# EAGLE board unicycle (EAGLE 4.11)
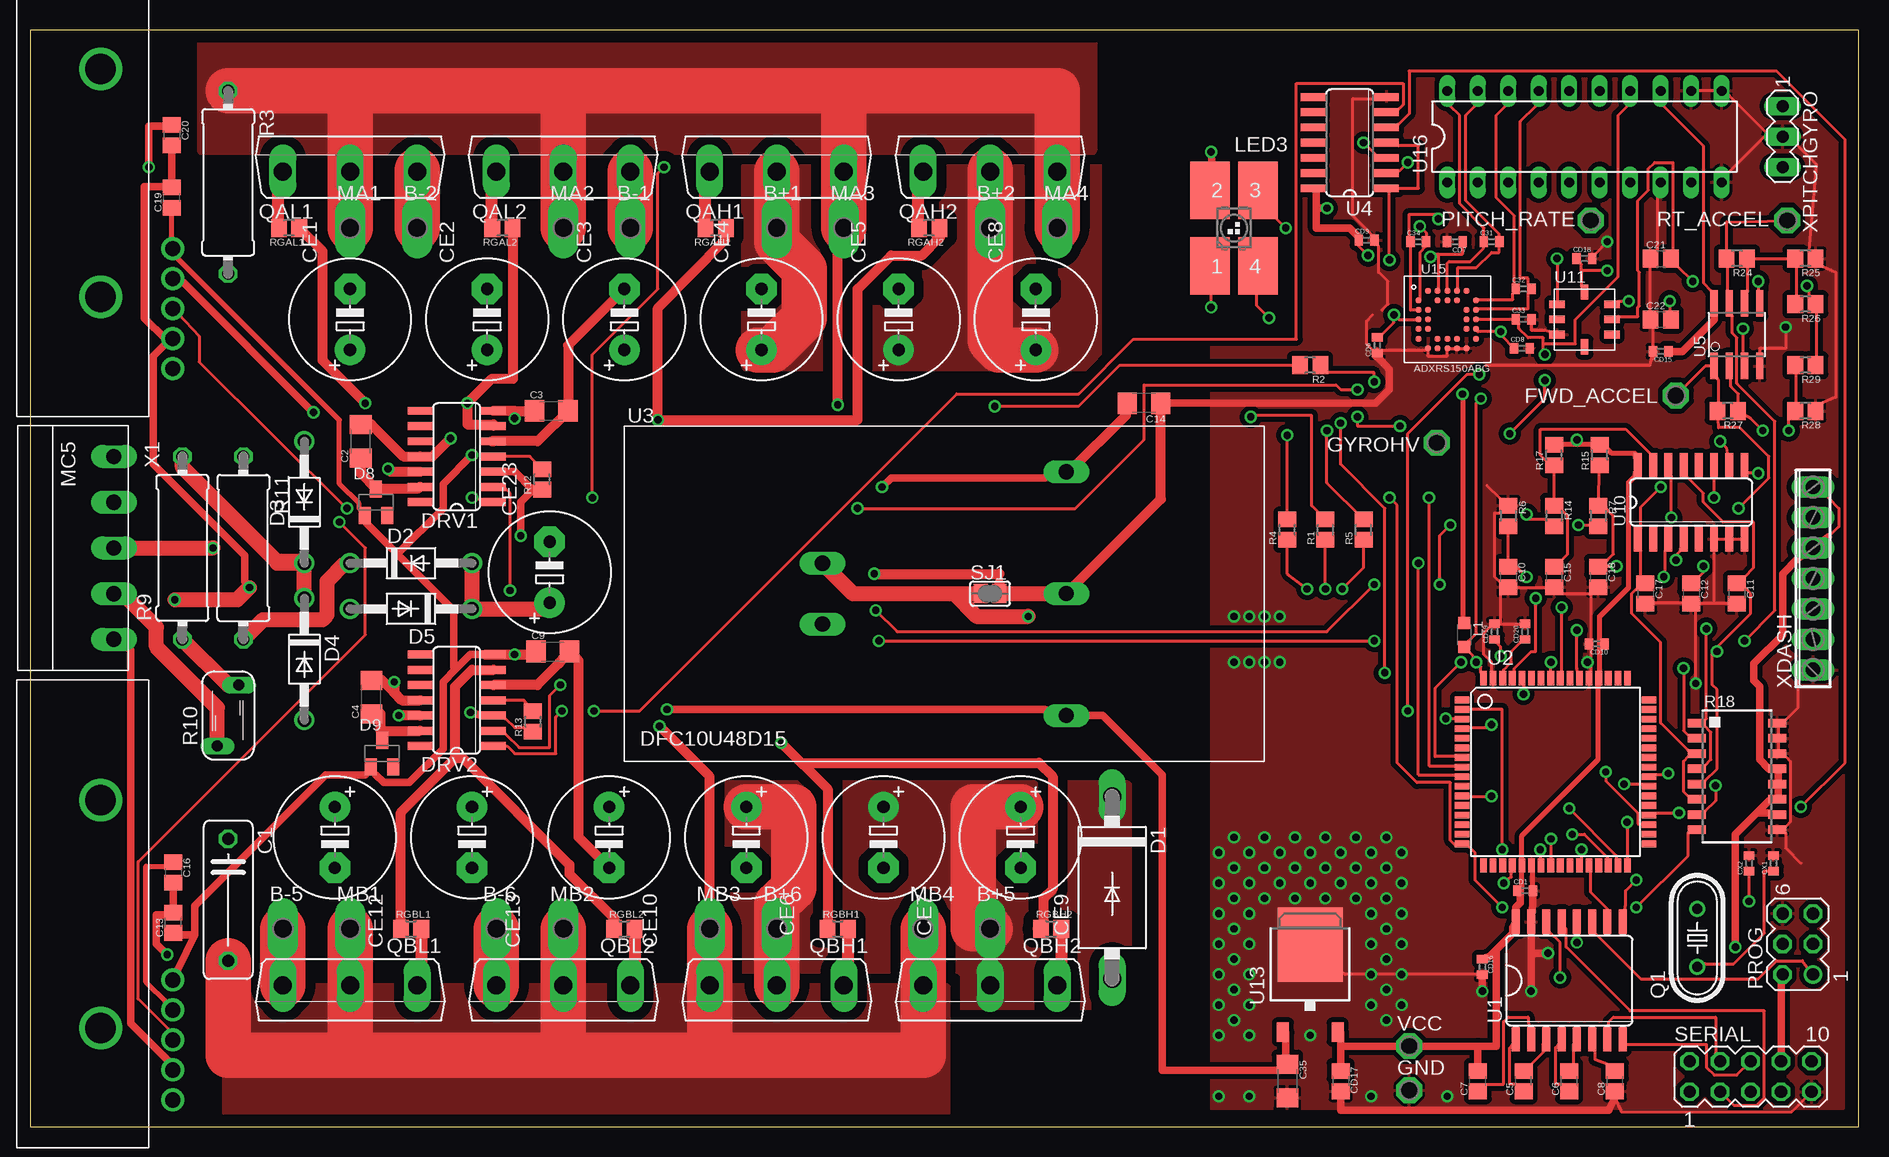
[diagram p3: board, top side]
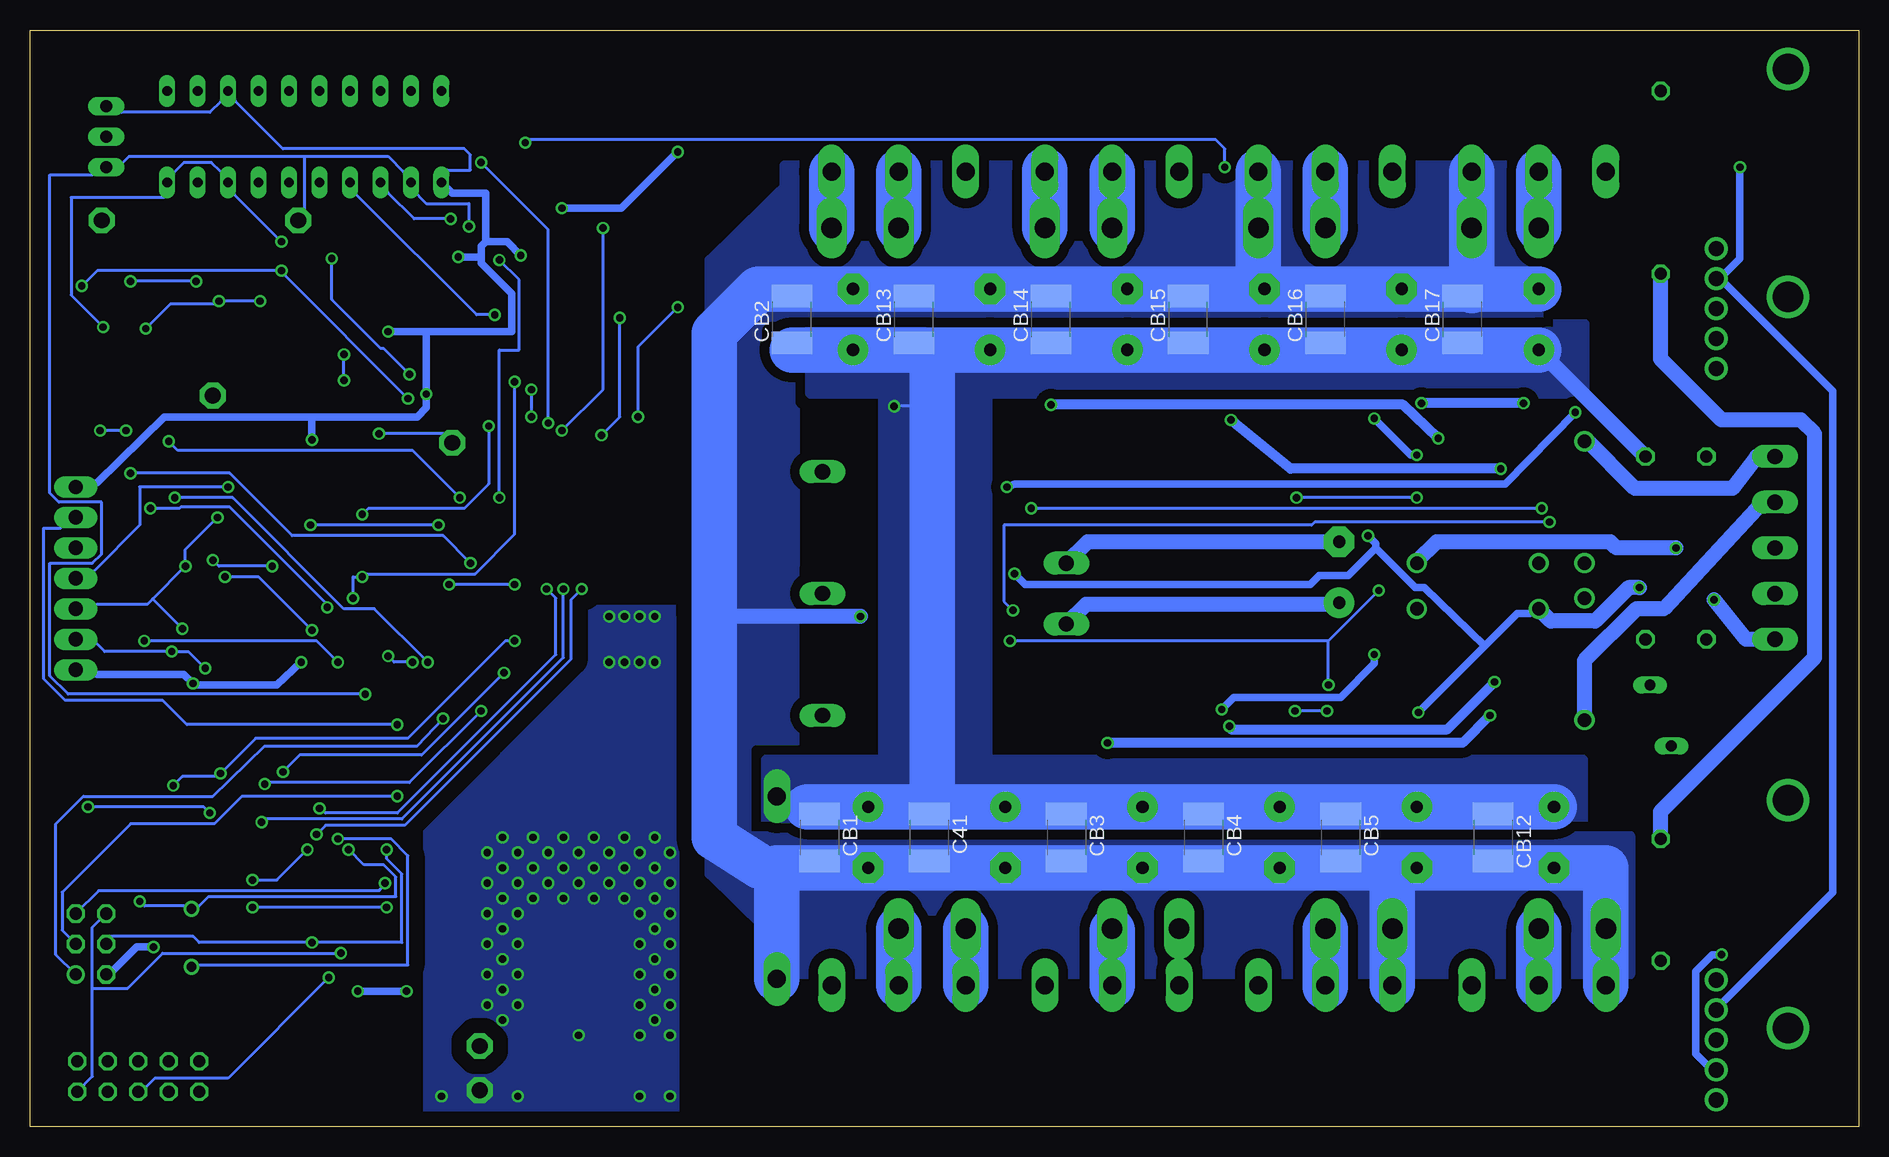
[diagram p4: board, bottom side, seen from below]

Size 152.4 x 91.44 mm. Coordinates in mm from the lower left corner, seen from the top.
Outline: 0,0 152.4,0 152.4,91.44 0,91.44 0,0
Copper layers (1*16): Top 0.035mm / dielectric 1.5mm / Bottom 0.035mm
Design rules "default": minimum track width 10mil, minimum drill 24mil, track to track 8mil, track to pad 8mil, pad to pad 8mil, via to via 8mil, smd to smd 8mil, copper to edge 40mil, drill to drill 8mil, minimum pad ring 10mil, minimum via ring 8mil, stop-mask expansion 4mil, vias tented up to drill 0mil, thermal gap 10mil
Net classes: 1 pwr: width 0.254 mm; 2 highsig: width 0.406 mm, clearance 0.61 mm; 3 highpwr: width 0.61 mm, clearance 0.61 mm

## Footprints (pad centres in the part's own frame; a part is rotated, then mirrored left to right if it is on the bottom)
P1-17Y = drill 1.702 pad 2.121 long: 1 0,0
L08P = drill 1.27 round: 1 -3,-3; 2 -5.5,-3; 3 -8,-3; 4 -10.5,-3; 5 -13,-3 | drill 2.54 round: P$6 -7,3; P$7 12,3
C102-043X133 = drill 1.016 octagon: 1 -5.08,0; 2 5.08,0
C1206 = smd 1.6 x 1.8: 1 -1.4,0; 2 1.4,0
C0805 = smd 1.3 x 1.5: 1 -0.85,0; 2 0.85,0
C0402 = smd 0.7 x 0.9: 1 -0.65,0; 2 0.65,0
C1812 = smd 1.9 x 3.4: 1 -1.95,0; 2 1.95,0
E5-10,5 = drill 1.016 pad 2.54 round: + -2.54,0 | drill 1.016 pad 2.54 octagon: - 2.54,0
DO201-15 = drill 1.499 long: A 7.62,0; C -7.62,0
DO41-10 = drill 1.118 round: A 5.08,0; C -5.08,0
SOT23 = smd 1 x 1.4: 1 -0.95,-1.1; 2 0.95,-1.1; 3 0,1.1
14-SOIC = smd 0.66 x 2.032: 1 -3.81,-3.073; 2 -2.54,-3.073; 3 -1.27,-3.073; 4 0,-3.073; 5 1.27,-3.073; 6 2.54,-3.073; 7 3.81,-3.073; 8 3.81,3.073; 9 2.54,3.073; 10 1.27,3.073; 11 0,3.073; 12 -1.27,3.073; 13 -2.54,3.073; 14 -3.81,3.073
P1-13 = drill 1.321 pad 2.159 octagon: 1 0,0
L2012C = smd 1 x 1: 1 -1,0; 2 1,0
P-LCC-4-3 = smd 3.3 x 4.8: 1 -2,-3.15; 2 -2,3.15; 3 2,3.15; 4 2,-3.15
MA03-2 = drill 1.016 round: 1 -2.54,-1.27 | drill 1.016 octagon: 2 -2.54,1.27; 3 0,-1.27; 4 0,1.27; 5 2.54,-1.27; 6 2.54,1.27
HC49/S = drill 0.813 round: 1 -2.413,0; 2 2.413,0
TO247BV = drill 1.499 long: D 0,-2.921; G -5.588,-2.921; S 5.588,-2.921
R0805 = smd 1.3 x 1.5: 1 -0.85,0; 2 0.85,0
0414/15 = drill 1.016 octagon: 1 -7.62,0; 2 7.62,0
S05K40 = drill 0.914 long: 1 -0.889,-2.54; 2 0.889,2.54
4816P = smd 0.7 x 1.5: 1 -4.445,-3.346; 2 -3.175,-3.346; 3 -1.905,-3.346; 4 -0.635,-3.346; 5 0.635,-3.346; 6 1.905,-3.346; 7 3.175,-3.346; 8 4.445,-3.346; 9 4.445,3.346; 10 3.175,3.346; 11 1.905,3.346; 12 0.635,3.346; 13 -0.635,3.346; 14 -1.905,3.346; 15 -3.175,3.346; 16 -4.445,3.346
MA05-2 = drill 1.016 octagon: 1 -5.08,-1.27; 2 -5.08,1.27; 3 -2.54,-1.27; 4 -2.54,1.27; 5 0,-1.27; 6 0,1.27; 7 2.54,-1.27; 8 2.54,1.27; 9 5.08,-1.27; 10 5.08,1.27
SJ = smd 1.168 x 1.6: 1 -0.762,0; 2 0.762,0
SO16L = smd 0.66 x 2.032: 1 -4.445,-4.902; 2 -3.175,-4.902; 3 -1.905,-4.902; 4 -0.635,-4.902; 5 0.635,-4.902; 6 1.905,-4.902; 7 3.175,-4.902; 8 4.445,-4.902; 9 4.445,4.902; 10 3.175,4.902; 11 1.905,4.902; 12 0.635,4.902; 13 -0.635,4.902; 14 -1.905,4.902; 15 -3.175,4.902; 16 -4.445,4.902
TQFP64 = smd 1.194 x 0.559: 1 -7.8,6; 2 -7.8,5.2; 3 -7.8,4.4; 4 -7.8,3.6; 5 -7.8,2.8; 6 -7.8,2; 7 -7.8,1.2; 8 -7.8,0.4; 9 -7.8,-0.4; 10 -7.8,-1.2; 11 -7.8,-2; 12 -7.8,-2.8; 13 -7.8,-3.6; 14 -7.8,-4.4; 15 -7.8,-5.2; 16 -7.8,-6; 33 7.8,-6; 34 7.8,-5.2; 35 7.8,-4.4; 36 7.8,-3.6; 37 7.8,-2.8; 38 7.8,-2; 39 7.8,-1.2; 40 7.8,-0.4; 41 7.8,0.4; 42 7.8,1.2; 43 7.8,2; 44 7.8,2.8; 45 7.8,3.6; 46 7.8,4.4; 47 7.8,5.2; 48 7.8,6 | smd 0.559 x 1.194: 17 -6,-7.8; 18 -5.2,-7.8; 19 -4.4,-7.8; 20 -3.6,-7.8; 21 -2.8,-7.8; 22 -2,-7.8; 23 -1.2,-7.8; 24 -0.4,-7.8; 25 0.4,-7.8; 26 1.2,-7.8; 27 2,-7.8; 28 2.8,-7.8; 29 3.6,-7.8; 30 4.4,-7.8; 31 5.2,-7.8; 32 6,-7.8; 49 6,7.8; 50 5.2,7.8; 51 4.4,7.8; 52 3.6,7.8; 53 2.8,7.8; 54 2,7.8; 55 1.2,7.8; 56 0.4,7.8; 57 -0.4,7.8; 58 -1.2,7.8; 59 -2,7.8; 60 -2.8,7.8; 61 -3.6,7.8; 62 -4.4,7.8; 63 -5.2,7.8; 64 -6,7.8
DFC10 = drill 1.27 long: 1 0,-2.54; 2 0,2.54; 3 20.32,-10.16; 4 20.32,0; 5 20.32,10.16
SO14 = smd 0.66 x 2.032: 1 -3.81,-3.073; 2 -2.54,-3.073; 3 -1.27,-3.073; 4 0,-3.073; 5 1.27,-3.073; 6 2.54,-3.073; 7 3.81,-3.073; 8 3.81,3.073; 9 2.54,3.073; 10 1.27,3.073; 11 0,3.073; 12 -1.27,3.073; 13 -2.54,3.073; 14 -3.81,3.073
SO08 = smd 0.61 x 2.21: 1 -1.905,-2.616; 2 -0.635,-2.616; 3 0.635,-2.616; 4 1.905,-2.616; 5 1.905,2.616; 6 0.635,2.616; 7 -0.635,2.616; 8 -1.905,2.616
SO16 = smd 0.66 x 2.032: 1 -4.445,-3.073; 2 -3.175,-3.073; 3 -1.905,-3.073; 4 -0.635,-3.073; 5 0.635,-3.073; 6 1.905,-3.073; 7 3.175,-3.073; 8 4.445,-3.073; 9 4.445,3.073; 10 3.175,3.073; 11 1.905,3.073; 12 0.635,3.073; 13 -0.635,3.073; 14 -1.905,3.073; 15 -3.175,3.073; 16 -4.445,3.073
E-8 = smd 1.27 x 0.635: 1 -2.286,1.27; 2 -2.286,0; 3 -2.286,-1.27; 5 2.286,-1.27; 6 2.286,0; 7 2.286,1.27 | smd 0.635 x 1.27: 4 0,-2.286; 8 0,2.286
TO252 = smd 1 x 1.6: 1 -2.28,-4.8; 2 2.28,-4.8 | smd 5.4 x 6.2: 3 0,2.5
BC-32 = smd 0.5 x 0.5: A2 -1.6,2.4; A3 -0.8,2.4; A4 0,2.4; A5 0.8,2.4; A6 1.6,2.4; B1 -2.4,1.6; B3 -0.8,1.6; B4 0,1.6; B5 0.8,1.6; B7 2.4,1.6; C1 -2.4,0.8; C2 -1.6,0.8; C6 1.6,0.8; C7 2.4,0.8; D1 -2.4,0; D2 -1.6,0; D6 1.6,0; D7 2.4,0; E1 -2.4,-0.8; E2 -1.6,-0.8; E6 1.6,-0.8; E7 2.4,-0.8; F1 -2.4,-1.6; F3 -0.8,-1.6; F4 0,-1.6; F5 0.8,-1.6; F7 2.4,-1.6; G2 -1.6,-2.4; G3 -0.8,-2.4; G4 0,-2.4; G5 0.8,-2.4; G6 1.6,-2.4
DIL20 = drill 0.813 long: 1 -11.43,-3.81; 2 -8.89,-3.81; 3 -6.35,-3.81; 4 -3.81,-3.81; 5 -1.27,-3.81; 6 1.27,-3.81; 7 3.81,-3.81; 8 6.35,-3.81; 9 8.89,-3.81; 10 11.43,-3.81; 11 11.43,3.81; 12 8.89,3.81; 13 6.35,3.81; 14 3.81,3.81; 15 1.27,3.81; 16 -1.27,3.81; 17 -3.81,3.81; 18 -6.35,3.81; 19 -8.89,3.81; 20 -11.43,3.81
MC5 = drill 1.27 long: 1 -7.62,0; 2 -3.81,0; 3 0,0; 4 3.81,0; 5 7.62,0
7POL254 = drill 1.2 long: 1 -7.62,0; 2 -5.08,0; 3 -2.54,0; 4 0,0; 5 2.54,0; 6 5.08,0; 7 7.62,0
MA03-1 = drill 1.016 long: 1 -2.54,0; 2 0,0; 3 2.54,0

## Placement (x,y rotation side)
B+1  PTR1PAD1-17Y  [P1-17Y]  62.23,74.93 0 top
B+2  PTR1PAD1-17Y  [P1-17Y]  80.01,74.93 0 top
B+5  PTR1PAD1-17Y  [P1-17Y]  80.01,16.51 0 top
B+6  PTR1PAD1-17Y  [P1-17Y]  62.23,16.51 0 top
B-1  PTR1PAD1-17Y  [P1-17Y]  50.04,74.93 0 top
B-2  PTR1PAD1-17Y  [P1-17Y]  32.26,74.93 0 top
B-5  PTR1PAD1-17Y  [P1-17Y]  21.08,16.51 0 top
B-6  PTR1PAD1-17Y  [P1-17Y]  38.86,16.51 0 top
BATIS  L08P150D15  [L08P]  8.89,15.24 90 top
C1  0.022uF100v  [C102-043X133]  16.51,18.92 270 top
C2  10uF25v  [C1206]  27.56,57.15 90 top
C3  10uF25v  [C1206]  43.43,59.69 0 top
C4  10uF25v  [C1206]  28.45,35.81 90 top
C5  1.0uF  [C0805]  124.46,3.81 90 top
C6  1.0uF  [C0805]  128.27,3.81 90 top
C7  1.0uF  [C0805]  120.65,3.81 90 top
C8  1.0uF  [C0805]  132.08,3.81 90 top
C9  10uF25v  [C1206]  43.56,39.62 0 top
C10  0.1uF  [C0805]  123.19,45.85 270 top
C11  0.1uF  [C0805]  142.24,44.45 270 top
C12  0.1uF  [C0805]  138.43,44.45 270 top
C13  0.1uF 25v  [C0805]  11.94,17.02 90 top
C14  10uF 25v  [C1206]  92.84,60.33 180 top
C15  0.1uF  [C0805]  127,45.85 270 top
C16  0.1uF 25v  [C0805]  11.94,21.21 270 top
C17  0.1uF  [C0805]  134.62,44.45 270 top
C18  0.1uF  [C0805]  130.68,45.85 270 top
C19  0.1uF 25v  [C0805]  11.81,77.47 90 top
C20  0.1uF 25v  [C0805]  11.81,82.68 270 top
C21  0.22uF  [C0805]  135.89,72.39 0 top
C22  0.22uF  [C0805]  135.89,67.31 0 top
C31  22nF  [C0402]  121.79,73.79 0 top
C32  22nF  [C0402]  124.46,69.85 0 top
C33  47nF  [C0402]  124.46,67.31 0 top
C34  10nF  [C0402]  115.7,73.79 0 top
C35  10uF 25v  [C1206]  104.78,3.81 270 top
C41  1uF100v  [C1812]  77.47,24.13 270 bottom
CB1  1uF100v  [C1812]  86.61,24.13 270 bottom
CB2  1uF100v  [C1812]  88.9,67.31 90 bottom
CB3  1uF100v  [C1812]  66.04,24.13 270 bottom
CB4  1uF100v  [C1812]  54.61,24.13 270 bottom
CB5  1uF100v  [C1812]  43.18,24.13 270 bottom
CB12  1uF100v  [C1812]  30.48,24.13 270 bottom
CB13  1uF100v  [C1812]  78.74,67.31 90 bottom
CB14  1uF100v  [C1812]  67.31,67.31 90 bottom
CB15  1uF100v  [C1812]  55.88,67.31 90 bottom
CB16  1uF100v  [C1812]  44.45,67.31 90 bottom
CB17  1uF100v  [C1812]  33.02,67.31 90 bottom
CD1  1uF 6v  [C0402]  124.59,19.68 0 top
CD6  1uF 6v  [C0402]  112.27,65.15 90 top
CD7  1uF 6v  [C0402]  118.75,73.79 180 top
CD8  1uF 6v  [C0402]  124.33,64.9 0 top
CD9  1uF 6v  [C0402]  111.38,73.91 0 top
CD10  1uF 6v  [C0402]  130.56,40.26 180 top
CD15  1uF 6v  [C0402]  135.89,64.64 180 top
CD16  1uF 6v  [C0402]  121.03,13.34 270 top
CD17  10uF 6v  [C0805]  109.22,3.81 270 top
CD18  1uF 6v  [C0402]  129.54,72.39 0 top
CD19  1uF 6v  [C0402]  122.05,41.27 90 top
CD20  1uF 6v  [C0402]  124.59,41.27 90 top
CE1  220uF 63v  [E5-10,5]  26.67,67.31 90 top
CE2  220uF 63v  [E5-10,5]  38.1,67.31 90 top
CE3  220uF 63v  [E5-10,5]  49.53,67.31 90 top
CE4  220uF 63v  [E5-10,5]  60.96,67.31 90 top
CE5  220uF 63v  [E5-10,5]  72.39,67.31 90 top
CE6  220uF 63v  [E5-10,5]  59.69,24.13 270 top
CE7  220uF 63v  [E5-10,5]  71.12,24.13 270 top
CE8  220uF 63v  [E5-10,5]  83.82,67.31 90 top
CE9  220uF 63v  [E5-10,5]  82.55,24.13 270 top
CE10  220uF 63v  [E5-10,5]  48.26,24.13 270 top
CE12  220uF 63v  [E5-10,5]  25.4,24.13 270 top
CE13  220uF 63v  [E5-10,5]  36.83,24.13 270 top
CE23  220uF63v  [E5-10,5]  43.31,46.23 90 top
CX1  18pF  [C0402]  145.29,21.97 90 top
CX2  18pF  [C0402]  143.26,21.97 90 top
D1  1.5ke51  [DO201-15]  90.17,19.94 270 top
D2  1N4004  [DO41-10]  31.75,46.99 0 top
D3  1N4004  [DO41-10]  22.86,52.07 90 top
D4  1N4004  [DO41-10]  22.86,38.99 270 top
D5  1N4004  [DO41-10]  31.75,43.18 180 top
D8  BAS21  [SOT23]  28.83,52.07 0 top
D9  BAS21  [SOT23]  29.34,31.11 0 top
DRV1  IR21844S  [14-SOIC]  35.56,55.88 90 top
DRV2  IR21844S  [14-SOIC]  35.56,35.56 90 top
FWD_ACCEL  TPSPAD1-13  [P1-13]  137.16,60.96 0 top
GND  TPPAD1-13  [P1-13]  114.94,3.05 0 top
GYROHV  TPSPAD1-13  [P1-13]  117.22,57.02 0 top
L1  10uH  [L2012C]  119.51,41.02 270 top
LED3  SML-LX2832SISUGSBC  [P-LCC-4-3]  100.33,74.93 0 top
MA1  PTR1PAD1-17Y  [P1-17Y]  26.67,74.93 0 top
MA2  PTR1PAD1-17Y  [P1-17Y]  44.45,74.93 0 top
MA3  PTR1PAD1-17Y  [P1-17Y]  67.82,74.93 0 top
MA4  PTR1PAD1-17Y  [P1-17Y]  85.6,74.93 0 top
MB1  PTR1PAD1-17Y  [P1-17Y]  26.67,16.51 0 top
MB2  PTR1PAD1-17Y  [P1-17Y]  44.45,16.51 0 top
MB3  PTR1PAD1-17Y  [P1-17Y]  56.64,16.51 0 top
MB4  PTR1PAD1-17Y  [P1-17Y]  74.42,16.51 0 top
PITCH_RATE  TPSPAD1-13  [P1-13]  130.05,75.56 0 top
PROG  [MA03-2]  147.32,15.24 90 top
Q1  14.7  [HC49/S]  138.94,15.75 90 top
QAH1  IRFP2907  [TO247BV]  62.23,82.55 0 top
QAH2  IRFP2907  [TO247BV]  80.01,82.55 0 top
QAL1  IRFP2907  [TO247BV]  26.67,82.55 0 top
QAL2  IRFP2907  [TO247BV]  44.45,82.55 0 top
QBH1  IRFP2907  [TO247BV]  62.23,8.89 180 top
QBH2  IRFP2907  [TO247BV]  80.01,8.89 180 top
QBL1  IRFP2907  [TO247BV]  26.67,8.89 180 top
QBL2  IRFP2907  [TO247BV]  44.45,8.89 180 top
R1  240  [R0805]  107.95,49.78 90 top
R2  190k  [R0805]  106.68,63.5 180 top
R3  5ohm 2W  [0414/15]  16.51,78.74 270 top
R4  240  [R0805]  104.78,49.78 90 top
R5  240  [R0805]  111.12,49.78 90 top
R6  10k  [R0805]  123.19,50.93 270 top
R7  10k 0.1%  [R0805]  130.68,50.93 270 top
R9  5ohm 2W  [0414/15]  12.7,48.26 90 top
R10  mf-rx110  [S05K40]  16.51,34.29 0 top
R11  1ohm 2W  [0414/15]  17.78,48.26 270 top
R12  20k  [R0805]  42.67,53.98 90 top
R13  20k  [R0805]  41.91,33.78 90 top
R14  10k 0.1%  [R0805]  127,50.93 270 top
R15  10k 0.1%  [R0805]  130.81,56.01 90 top
R17  10k 0.1%  [R0805]  127,56.01 90 top
R18  10k  [4816P]  142.24,29.21 270 top
R24  10k 0.1%  [R0805]  142.24,72.39 180 top
R25  10k 0.1%  [R0805]  147.96,72.39 180 top
R26  10k 0.1%  [R0805]  147.96,68.58 180 top
R27  10k 0.1%  [R0805]  141.48,59.69 180 top
R28  10k 0.1%  [R0805]  147.96,59.69 180 top
R29  10k 0.1%  [R0805]  147.96,63.5 180 top
RGAH1  5  [R0805]  57.15,74.93 180 top
RGAH2  5  [R0805]  74.93,74.93 180 top
RGAL1  5  [R0805]  21.59,74.93 180 top
RGAL2  5  [R0805]  39.37,74.93 180 top
RGBH1  5  [R0805]  67.31,16.51 0 top
RGBH2  5  [R0805]  85.09,16.51 0 top
RGBL1  5  [R0805]  31.75,16.51 0 top
RGBL2  5  [R0805]  49.53,16.51 0 top
RMIS  L08P150D15  [L08P]  8.89,76.2 90 top
RT_ACCEL  TPSPAD1-13  [P1-13]  146.43,75.56 0 top
SERIAL  [MA05-2]  143.38,4.19 0 top
SJ1  [SJ]  80.01,44.45 0 top
U1  MAX232ECWE  [SO16L]  128.27,12.19 0 top
U2  MEGA128-A  [TQFP64]  127.13,29.59 0 top
U3  DFC10U48D15  [DFC10]  66.04,44.45 0 top
U4  74HC08D  [SO14]  109.98,82.04 90 top
U5  OPA2340U  [SO08]  142.24,66.04 0 top
U10  74HC4051D  [SO16]  138.43,52.07 0 top
U11  ADXL311JE  [E-8]  129.54,67.31 0 top
U13  LM78M05CDT  [TO252]  106.68,12.7 0 top
U15  ADXRS150ABG  [BC-32]  118.11,67.31 0 top
U16  ADXRS150ABGEB  [DIL20]  129.54,82.55 0 top
VCC  TPPAD1-13  [P1-13]  114.94,6.73 0 top
X1  MC5  [MC5]  6.99,48.26 270 top
XDASH  [7POL254]  148.59,45.72 90 top
XPITCHGYRO  [MA03-1]  146.05,82.55 270 top

## Tracks (layer width: path | path; a pad name or v marks a point on that pad's centre or on a via)
+15V  (via drill 0.61)
  Top 0.254: U13.1 104.65,7.11 C35.1 | 28.83,29.34 D9.1 27.94,29.34
  Top 0.406: 35.5,38.16 35.31,38.35 | D8.1 27.43,51.56 27.43,51.94 25.78,53.59 25.78,58.93 12.32,72.39 RMIS.1 11.81,74.04 C19.1
  Top 0.61: U13.1 104.65,7.87 104.65,4.7 94.36,4.7 94.36,29.34 89.41,34.29 U3.3 84.58,34.8 v53.09,34.8 | 28.83,29.34 29.46,28.7 31.62,28.7 34.42,31.5 34.42,37.08 35.5,38.16 36.7,39.37 37.97,39.37 | 30.61,47.75 35.31,43.05 35.31,38.35 | 30.35,48.01 28.07,50.29 D8.1 | v36.83,56.01 34.42,53.59 34.42,51.56 30.61,47.75 | v40.39,59.05 40.39,59.69 | 30.35,48.01 30.29,48.07 | 30.61,47.75 30.35,48.01 | 13.72,16 12.32,13.08 BATIS.1 | 13.72,16 13.72,18.41 24.64,29.34 27.94,29.34 | 13.72,16 12.57,16 C13.1
  Top 0.813: 37.97,39.37 DRV2.7 v40.39,39.37 41.91,39.37 C9.1 | C3.1 40.39,59.69 DRV1.7
  Bottom 0.61: v40.39,59.05 37.34,56.01 v36.83,56.01 | v40.39,39.37 40.39,38.61 43.18,35.81 52.07,35.81 v53.09,34.8
-15V  (via drill 0.61)
  Top 0.254: 11.3,21.72 C16.1
  Top 0.406: 11.3,21.72 9.65,21.72 9.65,12.06 11.43,10.29 BATIS.2
  Top 0.61: v23.62,59.56 12.83,70.36 RMIS.2 | v9.91,80.01 9.91,83.44 11.18,83.44 C20.1 | v70.99,53.34 71.75,54.1 84.58,54.1 U3.5
  Top 0.813: C14.2 | C14.2 | U3.5 86.61,54.61 91.31,59.31 C14.2
  Bottom 0.61: BATIS.2 11.3,10.41 2.16,19.56 2.16,61.34 11.05,70.23 RMIS.2 11.56,70.74 9.91,72.39 v9.91,80.01 | v23.62,59.56 29.46,53.59 70.36,53.59 v70.99,53.34
/RESET  (via drill 0.61)
  Top 0.254: v122.81,20.32 123.44,20.83 123.44,21.21 U2.20
  Bottom 0.254: v122.81,20.32 123.32,19.68 146.69,19.68 PROG.5
ACCEL_ST  (via drill 0.61)
  Top 0.254: v132.84,28.57 134.37,28.57 U2.39 | v114.81,34.67 114.81,57.78 119.76,62.74 v120.78,62.74 | v127.25,72.39 U11.1
  Bottom 0.254: v132.84,28.57 132.72,28.7 120.78,28.7 v114.81,34.67 | v120.78,62.74 122.94,64.9 123.19,64.9 127.25,68.96 v127.25,72.39
ADCMUX1  (via drill 0.61)
  Top 0.254: v128.91,41.4 128.91,38.23 U2.54 | v136.14,45.85 136.27,45.97 136.27,48.01 U10.3
  Bottom 0.254: v128.91,41.4 133.35,45.85 v136.14,45.85
AREF
  Top 0.254: CD20.1 124.21,40.39 123.44,39.62 123.44,38.73 122.81,38.1 122.81,37.97 U2.62
AVCC  (via drill 0.61)
  Top 0.254: v122.56,39.24 122.56,40.01 122.05,40.51 CD19.1 | U2.64 120.9,37.97 120.9,38.35 v120.52,38.73 120.27,39.12 120.27,39.24 119.89,39.62 L1.2 119.89,40.51 120.52,41.15 120.52,60.33 v120.9,60.71 | 129.29,71.37 129.29,70.1 U11.8 | 129.29,71.37 129.29,71.88 129.16,72.01 CD18.1 | R29.1 148.84,64.14 148.84,67.94 R26.1 148.21,69.22 148.21,69.98 v148.08,70.1 | v131.44,71.37 129.29,71.37
  Bottom 0.254: v122.56,39.24 122.05,38.73 v120.52,38.73 | v148.08,70.1 146.81,71.37 v131.44,71.37 131.19,70.99 v120.9,60.71
B+  (via drill 0.61)
  Top 0.254: R2.2 90.81,63.5 87.38,60.07 v80.39,60.07
  Top 3.81: QBH1.D B+6.1 62.23,18.54 63.63,19.94 63.63,26.67 CE6.+ | CE9.+ 78.61,26.67 78.61,16.51 B+5.1 | 60.71,64.77 CE4.+ 61.85,64.77 64.52,67.44 64.52,71.5 62.23,73.79 B+1.1 QAH1.D | CE8.+ 80.77,64.77 80.01,65.53 B+2.1 80.01,79.76
  Bottom 0.254: 77.09,60.07 77.22,60.07 v80.39,60.07
  Bottom 0.813: 88.9,64.77 CB2.1 | 87.63,26.67 CB1.1
  Bottom 1.27: CE1.+ R11.1
  Bottom 3.81: CE12.+ CE13.+ CE10.+ CE6.+ CE7.+ 77.22,26.67 | 77.22,26.67 CE9.+ 87.63,26.67 | B+2.1 QAH2.D | B+1.1 QAH1.D | B+5.1 QBH2.D | 77.22,64.77 CE5.+ CE4.+ CE3.+ CE2.+ CE1.+ | 77.22,64.77 CE8.+ 88.9,64.77 | QBH1.D 62.23,16.38 | 77.22,26.67 77.22,60.07 77.22,64.77
  pour Top (isolate 0.813, rank 2, no thermals): 57.4,28.45 57.4,10.16 91.44,10.16 91.44,28.45
  pour Top (isolate 0.813, rank 2, no thermals): 59.69,80.14 88.9,80.14 88.9,63.37 59.69,63.37
  pour Bottom (isolate 0.813, rank 3, no thermals): 22.99,30.61 22.99,25.4 91.06,25.4 91.06,30.61
  pour Bottom (isolate 0.813, rank 3, no thermals): 22.86,66.93 22.86,61.09 87.38,61.09 87.38,66.93
  pour Bottom (isolate 0.813, rank 3, no thermals): 72.64,64.77 72.64,28.07 81.28,28.07 81.28,64.77
B-  (via drill 0.61)
  Top 0.813: DRV2.5 42.29,36.83 44.07,38.61 C9.2 45.72,38.86 45.72,24.13 CE10.- | 38.48,57.15 DRV1.5 42.29,57.15 C3.2 44.83,65.15 CE3.-
  Top 1.27: U3.2 68.58,44.45 76.96,44.45 | 76.96,44.45 SJ1.1 | C9.2 | 76.96,44.45 78.87,42.55 v83.19,42.55
  Top 3.81: QBL1.S B-5.1 | B-6.1 QBL2.S | B-1.1 QAL2.S | B-2.1 32.26,79.76
  Bottom 1.27: U3.2 64.26,48.77 CE23.- | v83.19,42.55 95.38,42.55
  Bottom 3.81: 38.86,21.59 CE13.- CE12.- 21.08,21.59 B-5.1 QBL1.S | 38.86,21.59 CE10.- CE6.- CE7.- CE9.- 90.17,21.59 D1.A | 38.86,21.59 B-6.1 QBL2.S | QAL2.S B-1.1 50.04,69.85 | QAL1.S B-2.1 32.26,69.85 | 32.26,69.85 CE1.- | 32.26,69.85 CE2.- CE3.- 50.04,69.85 | 50.04,69.85 CE4.- CE5.- CE8.- | 32.26,69.85 32.26,69.72 | CE8.- 88.39,69.85 | CE8.- 91.69,69.85 95.38,66.17 95.38,42.55 95.38,24.13 91.57,21.72
  pour Bottom (isolate 0.813, no thermals): 19.05,24.26 19.05,12.7 91.44,12.7 91.44,24.26
  pour Bottom (isolate 0.813, rank 2, no thermals): 26.67,80.14 89.53,80.14 89.53,67.31 26.67,67.31
  pour Bottom (isolate 0.813, rank 4, no thermals): 88.65,79.25 88.77,14.22 95.76,21.08 95.76,72.26
BAT1
  Bottom 1.27: D3.A 22.73,57.28 18.67,53.21 10.54,53.21 8.51,55.88 X1.1
BAT2
  Bottom 1.27: D4.A 22.86,38.86 18.54,43.18 16.26,43.18 8,52.07 X1.2
BATBOTH
  Top 1.27: R10.1 15.62,34.92 10.54,40.01 10.54,41.66 7.75,44.45 X1.4
BATIS  (via drill 0.61)
  Top 0.254: R15.1 R7.1 131.44,51.44 131.95,50.93 131.95,47.75 131.44,47.24 C18.1 131.44,46.74 v132.21,46.74 | v137.16,47.24 137.16,47.62 137.54,48.01 U10.4
  Bottom 0.254: v137.16,47.24 136.65,46.74 v132.21,46.74
BATISIN  (via drill 0.61)
  Top 0.254: v129.03,50.16 130.18,50.16 R7.2 | v25.78,50.42 27.94,48.26 27.94,41.02 9.02,22.1 9.02,10.67 11.56,8.13 BATIS.3 | v118.36,50.16 117.47,49.28 v117.47,45.21 | v112.01,45.21 108.08,41.27 72.26,41.27 v70.48,43.05
  Bottom 0.254: v25.78,50.42 45.34,50.42 45.59,50.16 71.25,50.16 71.25,43.81 v70.48,43.05 | v112.01,45.21 v117.47,45.21 | v118.36,50.16 v129.03,50.16
BEEPER  (via drill 0.61)
  Top 0.254: v121.79,33.53 121.79,33.27 119.89,33.27 U2.4
  Bottom 0.254: v121.79,33.53 139.32,33.53 141.35,35.56 149.48,35.56 151.26,37.34 151.26,49.91 149.86,49.91 XDASH.6
EXTRAMUX0  (via drill 0.61)
  Top 0.254: v119.25,38.73 117.09,36.58 117.09,30.86 118.75,30.86 U2.7 | v140.34,52.45 U10.11
  Bottom 0.254: v119.25,38.73 123.7,43.18 126.24,43.18 135.51,52.45 v140.34,52.45
EXTRAMUX1  (via drill 0.61)
  Top 0.254: v116.59,52.45 116.59,30.1 118.75,30.1 U2.8 | v140.84,57.15 141.35,56.64 U10.10
  Bottom 0.254: v116.59,52.45 120.52,56.39 140.08,56.39 v140.84,57.15
EXTRAMUX2  (via drill 0.61)
  Top 0.254: v115.7,46.99 115.7,29.34 118.75,29.34 U2.9 | v144.02,54.48 143.13,54.48 U10.9
  Bottom 0.254: v115.7,46.99 117.98,49.28 130.56,49.28 135.76,54.48 v144.02,54.48
FWD_ACCEL  (via drill 0.61)
  Top 0.254: v127.64,43.31 127.64,37.97 U2.56 | v142.37,51.56 144.91,54.1 144.91,55.88 142.49,58.29 140.72,58.29 R27.2 140.72,60.45 140.72,62.23 140.59,62.36 U5.1 139.62,63.42 FWD_ACCEL.1
  Bottom 0.254: v127.64,43.31 127.64,43.56 135.76,51.69 139.83,51.69 139.95,51.56 v142.37,51.56
GAH  (via drill 0.61)
  Top 0.813: RGAH1.1 58,74.51 57.91,73.91 52.32,68.24 v52.32,58.93 68.96,58.93 68.96,69.85 71.75,72.64 74.3,72.64 75.82,74.17 75.78,74.21 RGAH2.1 | v29.84,54.86 30.1,54.61 DRV1.12
  Bottom 0.813: v52.32,58.93 47.37,54.86 v29.84,54.86
GAL  (via drill 0.61)
  Top 0.813: RGAL1.1 24.38,72.99 24.38,63.88 v27.94,60.33 | DRV1.6 38.61,58.45 38.61,58.55 36.45,58.55 v36.45,60.33 38.48,62.36 40.26,62.36 40.26,74.89 RGAL2.1
  Bottom 0.813: v27.94,60.33 v36.45,60.33
GBH  (via drill 0.61)
  Top 0.813: RGBH1.1 66.46,28.16 v62.61,32 64.26,30.35 84.07,30.35 85.22,29.21 85.22,19.81 84.45,19.05 84.45,16.64 83.95,16.51 RGBH2.1 | DRV2.12 32.49,34.27 32.51,34.29 DRV2.12 | DRV2.12 v30.73,34.29
  Bottom 0.813: v62.61,32 33.02,32 v30.73,34.29
GBL
  Top 0.813: RGBL1.1 30.9,26.2 35.43,30.73 | 35.43,30.73 35.43,36.7 36.83,38.1 DRV2.6 | RGBL2.1 48.68,17.36 44.96,21.08 44.96,21.84 36.07,30.73 35.43,30.73
GND  (via drill 0.61)
  Top 0.254: R13.1 41.53,33.27 40.39,33.27 39.62,34.04 DRV2.3 | C33.2 125.09,66.42 126.24,66.42 126.75,66.29 U11.3 | U16.8 135.64,77.47 135.64,73.03 C21.1 135,71.75 135,67.94 C22.1 135.25,66.67 135.25,64.01 CD15.2 135,63.5 121.41,63.5 121.35,63.44 | v131.44,73.79 130.43,72.77 CD18.2 | v146.3,66.67 146.3,64.9 144.15,64.9 U5.4 | R28.1 149.35,60.33 150.5,60.83 150.5,71.25 149.35,71.75 R25.1 148.21,73.03 148.84,80.26 147.19,81.92 XPITCHGYRO.2 | U16.12 U16.11 141.6,85.98 144.65,82.93 XPITCHGYRO.2 | U16.10 141.6,79.63 144.65,82.68 XPITCHGYRO.2 | 130.05,40.26 130.05,44.32 130.11,44.39 | 130.05,40.26 130.05,38.73 | 130.05,38.73 130.05,37.97 U2.53 | 130.11,44.39 130.18,44.45 C18.2 | 122.43,41.91 124.21,41.91 CD20.2 | U2.63 121.79,37.97 121.79,38.73 121.16,39.37 121.16,41.15 121.67,41.66 CD19.2 122.43,41.91 | C10.2 123.83,44.96 126.36,44.96 C15.2 127.64,44.45 130.05,44.45 130.11,44.39 | C10.2 122.56,45.34 122.05,45.85 122.05,51.18 122.56,51.18 R6.1 122.56,52.32 121.41,53.47 | 122.43,41.91 122.56,42.04 122.56,44.45 C10.2 | 111.89,67.69 111.38,67.18 111.38,65.28 111.89,64.77 CD6.1 112.65,64.77 116.33,64.77 U15.G2 116.46,64.77 116.46,64.26 118.11,64.26 U15.G4 118.24,64.9 118.75,64.9 U15.G5 119.13,64.9 119.51,64.9 U15.G6 119.89,64.9 | 112.65,68.07 113.16,68.58 113.16,70.48 112.39,71.25 112.39,73.41 112.27,73.53 CD9.2 111.76,74.42 110.24,75.95 110.24,85.72 112.14,85.72 U4.7 | U10.8 142.62,49.02 141.86,49.02 U10.7 141.35,49.02 140.59,49.02 U10.6 140.34,43.69 | C17.2 135.25,43.69 137.79,43.69 C12.2 | 140.34,43.69 139.06,43.69 C12.2 | 140.34,43.69 141.6,43.69 C11.2 | XDASH.1 147.32,37.21 147.32,34.92 146.3,33.91 R18.16 145.67,33.4 145.67,32.64 R18.15 145.67,32.13 145.67,31.37 R18.14 146.3,30.86 146.69,30.48 146.69,25.4 146.3,25.02 R18.9
  Top 0.254: R18.9 144.91,24.51 | 147.57,21.97 146.3,23.24 146.3,24.51 R18.9 | PROG.6 145.67,18.41 | v138.81,36.96 138.81,43.05 C12.2 | CD16.2 120.9,12.7 109.6,12.7 U13.3 | SERIAL.9 146.81,1.27 132.59,1.27 132.08,2.41 C8.1 | 130.05,38.73 v129.79,38.73 | RMIS.4 11.3,65.66 | 130.05,40.26 CD10.2 | 125.22,19.68 CD1.2
  Top 0.406: 125.22,19.68 125.22,21.46 U2.22
  Top 0.61: 41.91,53.09 40.39,54.61 DRV1.3 | v36.7,34.54 37.59,34.29 DRV2.3 | 41.91,53.09 40.89,52.07 v40.89,49.28 | 41.91,53.09 R12.1 | BATIS.4 11.43,5.59 8.38,8.64 8.38,39.75 X1.5 | RMIS.4 11.3,65.28 10.29,64.26 10.29,55.24 17.91,47.62 17.91,45.47 v18.29,44.96 | 125.22,19.68 125.22,18.54 U1.15 125.09,14.48 | v126.49,14.48 125.09,14.48 | 132.08,2.41 131.57,1.4 109.22,1.4 CD17.2 | C20.2 C19.2 11.18,78.36 9.53,78.36 9.53,67.44 11.3,65.66 | C16.2 C13.2 11.3,17.65 10.54,17.65 10.54,15.24 v11.43,14.35 | C14.1 112.14,60.33 113.28,61.47 113.28,63.12 112.27,64.26 | 80.77,46.1 80.77,45.21 | v121.03,11.3 CD16.2 | 125.09,14.48 v125.09,11.3
  Top 0.813: U3.4 94.23,52.32 C14.1 | 112.27,64.52 CD6.1 112.27,64.26 | v70.36,46.1 80.77,46.1 | 80.77,45.21 SJ1.2
  Top 1.27: SJ1.2 U3.4 | v12.06,43.94 17.27,43.94 v18.29,44.96
  Bottom 0.254: v131.44,73.79 135.38,77.72 U16.8 136.53,79.63 137.29,80.39 139.57,80.39 140.34,79.63 U16.10 141.22,77.47 148.97,77.47 148.97,69.34 v146.3,66.67 | 147.19,11.56 147.19,16.64 PROG.6 | 147.19,11.56 147.19,4.19 SERIAL.9 | v126.49,14.48 141.35,14.48 144.27,11.56 147.19,11.56
  Bottom 0.61: 31.18,40.07 28.45,42.8 27.43,42.8 D5.A | 31.18,40.07 v36.7,34.54 | 40.26,48.26 40.26,48.64 v40.89,49.28 | 31.18,40.07 36.2,44.96 36.96,44.96 40.26,48.26 | XDASH.1 146.81,37.72 139.57,37.72 v138.81,36.96 138.43,36.83 131.83,36.83 v129.79,38.73 | 40.26,48.26 42.55,45.97 44.96,45.97 45.72,45.21 69.47,45.21 v70.36,46.1 | v11.43,14.35 12.19,14.35 13.59,12.95 13.59,6.1 12.32,4.83 BATIS.4 | v125.09,11.3 v121.03,11.3
  Bottom 1.27: X1.5 9.4,40.64 v12.06,43.94 | v18.29,44.96 19.18,44.96 21.97,42.16 25.65,42.16 D5.A
  other vias: 106.68,7.62 101.6,7.62 100.33,8.89 101.6,10.16 100.33,11.43 101.6,12.7 100.33,13.97 101.6,15.24 100.33,16.51 101.6,17.78 100.33,19.05 101.6,20.32 102.87,21.59 104.14,20.32 105.41,21.59 106.68,20.32 107.95,21.59 109.22,20.32 110.49,21.59 111.76,20.32 113.03,19.05 111.76,17.78 113.03,16.51 111.76,15.24 113.03,13.97 111.76,12.7 113.03,11.43 111.76,10.16 113.03,8.89 99.06,7.62 99.06,10.16 99.06,12.7 99.06,15.24 99.06,17.78 99.06,20.32 100.33,21.59 101.6,22.86 104.14,22.86 106.68,22.86 109.22,22.86 111.76,22.86 113.03,21.59 114.3,20.32 114.3,17.78 114.3,15.24 114.3,12.7 114.3,10.16 101.6,2.54 111.76,2.54 99.06,2.54 118.11,2.54 100.33,38.73 101.6,38.73 102.87,38.73 104.14,38.73 100.33,42.55 101.6,42.55 102.87,42.55 104.14,42.55 100.33,24.13 102.87,24.13 105.41,24.13 107.95,24.13 110.49,24.13 113.03,24.13 114.3,22.86 99.06,22.86 105.41,19.05 107.95,19.05 102.87,19.05 110.49,19.05
  pour Top (isolate 0.406, rank 4): 98.42,89.92 98.42,1.52 151.13,1.52 151.13,89.92
  pour Top (isolate 0.813, rank 4, no thermals): 103.12,19.18 103.12,11.81 110.87,11.81 110.87,19.18
  pour Bottom (isolate 1.27, rank 5, no thermals): 98.42,43.43 98.42,1.27 119.51,1.27 119.51,43.43
KNOB1  (via drill 0.61)
  Top 0.254: v137.79,38.23 137.79,33.02 138.18,32.64 R18.2 | 140.4,39.81 143.38,42.8 143.38,44.45 142.88,44.96 C11.1 142.88,45.85 143.64,46.61 143.64,50.42 141.1,50.42 139.45,52.07 139.45,52.83 138.05,54.23 U10.13 | 140.4,39.81 140.21,39.62 140.21,36.83 140.59,36.45 140.59,29.84 139.57,28.83 R18.5 | 140.4,39.81 v140.59,39.62
  Bottom 0.254: v137.79,38.23 139.19,39.62 v140.59,39.62 146.18,39.62 146.81,40.26 XDASH.2
KNOB2  (via drill 0.61)
  Top 0.254: R18.4 139.57,30.1 140.08,30.61 140.08,32.89 139.57,33.4 R18.1 139.57,33.91 139.7,34.04 v139.7,41.53 | v139.45,46.74 139.45,46.23 139.06,45.85 C12.1 | v136.78,50.8 136.78,54.23 U10.14
  Bottom 0.254: 142.18,44.01 142.62,43.56 146.81,43.56 XDASH.3 | 142.18,44.01 v139.45,46.74 139.45,48.13 v136.78,50.8 | v139.7,41.53 142.18,44.01
KNOB3  (via drill 0.61)
  Top 0.254: R18.6 138.18,27.56 137.79,27.94 137.79,30.48 138.18,30.86 R18.3 138.18,31.37 135.89,33.66 135.89,40.39 133.48,42.8 133.48,44.45 133.99,44.96 C17.1 134.24,45.85 134.24,48.01 U10.1 134.24,49.91 134.24,51.69 v135.89,53.34
  Bottom 0.254: v135.89,53.34 143.26,53.34 143.26,50.16 147.07,46.35 XDASH.4
L_PWM_ENABLE  (via drill 0.61)
  Top 0.254: v136.53,29.46 136.4,29.34 135.38,29.34 U2.40 | v44.2,36.83 43.31,35.94 43.31,31.62 40.77,31.62 39.62,32.77 DRV2.2 | v40.01,44.7 40.01,52.83 39.62,53.21 DRV1.2 | v70.74,40.51 v112.01,40.51 | v140.46,28.45 140.46,27.18 139.57,26.29 R18.7
  Bottom 0.254: v44.2,36.83 44.2,40.51 | 44.2,40.51 v40.01,44.7 | 44.2,40.51 v70.74,40.51 | v112.01,40.51 112.78,40.51 120.9,32.38 133.6,32.38 v136.53,29.46 136.78,29.21 139.7,29.21 v140.46,28.45
L_PWM_FWD  (via drill 0.61)
  Top 0.254: v131.32,29.59 131.32,28.83 133.99,26.16 133.99,25.27 134.37,25.27 U2.35 | v112.9,37.85 112.9,51.56 109.22,55.24 v109.22,58.67 | v114.81,80.39 114.05,79.63 U4.2
  Bottom 0.254: v131.32,29.59 129.92,30.99 119.76,30.99 v112.9,37.85 | v109.22,58.67 109.22,74.8 v114.81,80.39
L_PWM_REV  (via drill 0.61)
  Top 0.254: v137.41,26.16 135.51,26.16 U2.36 | v147.57,26.67 151.26,30.35 151.26,82.3 145.54,88.01 114.94,88.01 114.94,84.45 114.05,83.57 U4.5
  Bottom 0.254: v137.41,26.16 137.92,26.67 v147.57,26.67
LED1  (via drill 0.61)
  Top 0.254: v133.1,25.4 133.1,22.35 U2.32 | v107.95,44.83 R1.1
  Bottom 0.254: v107.95,44.83 107.95,39.12 121.41,25.65 132.72,25.65 v133.1,25.4
LED2  (via drill 0.61)
  Top 0.254: v128.27,26.54 132.21,22.61 132.21,22.35 U2.31 | v109.35,44.83 111.12,46.61 R5.1
  Bottom 0.254: 128.14,26.67 v128.27,26.54 127.89,26.29 127.76,26.16 121.79,26.16 108.58,39.37 108.58,44.07 v109.35,44.83
LMIS
  Top 0.254: C15.1 127.64,47.24 128.14,47.75 128.14,50.93 127.64,51.44 R14.1 R17.1 126.36,55.5 125.86,56.01 125.86,58.17 132.97,58.17 135,56.13 U10.15
LMISIN  (via drill 0.61)
  Top 0.254: v124.71,51.05 124.71,50.67 126.36,50.67 R14.2 | v26.42,51.56 14.1,63.75 14.1,65.91 12.32,67.82 RMIS.3 | v114.17,58.42 110.62,58.42 v110.62,59.18 | v110.62,61.47 109.22,61.47 108.84,61.85 92.84,61.85 92.84,57.28 87.12,51.56 v68.96,51.56
  Bottom 0.254: v124.71,51.05 124.21,51.56 116.2,51.56 114.17,53.59 v114.17,58.42 | v110.62,61.47 v110.62,59.18 | v26.42,51.56 v68.96,51.56
MA  (via drill 0.61)
  Top 0.406: DRV1.11 32.51,55.88
  Top 0.813: DRV1.11 31.11,55.88 28.45,58.55 27.69,58.55 27.68,58.55 C2.2 | MA1.1 26.67,74.8 | MA3.1 67.31,74.42 v67.31,60.2 | v35.05,57.4 33.53,55.88 32.51,55.88
  Top 3.81: 26.67,86.36 QAL1.D MA1.1 | 44.45,86.36 26.67,86.36 | 44.45,86.36 QAL2.D MA2.1 | 67.82,86.36 QAH1.S MA3.1 | 67.82,86.36 44.45,86.36 | 67.82,86.36 85.6,86.36 QAH2.S MA4.1 | 26.67,86.36 R3.1
  Bottom 0.813: v67.31,60.2 37.97,60.2 v35.05,57.4
  Bottom 3.81: QAL1.D MA1.1 | MA2.1 44.45,79.76 | MA3.1 67.82,79.76 | QAH2.S MA4.1
  pour Top (isolate 0.813): 14.35,81.41 14.35,90.68 88.52,90.68 88.52,81.41
MB  (via drill 0.61)
  Top 0.813: C4.2 28.32,37.21 29.34,37.21 30.35,36.2 | DRV2.11 30.99,35.56 30.35,36.2 | v30.35,37.08 30.35,36.2 | v52.45,33.4 56.64,29.21 MB3.1
  Top 3.81: MB1.1 QBL1.D 26.67,5.97 | 44.45,5.97 QBL2.D MB2.1 | MB3.1 QBH1.S 56.64,5.97 | 26.67,5.97 44.45,5.97 | 44.45,5.97 56.64,5.97 | MB4.1 QBH2.S 74.42,5.97 56.64,5.97 | C1.2 16.51,5.97 26.67,5.97
  Bottom 0.813: v30.35,37.08 34.29,33.15 52.32,33.15 v52.45,33.4
  Bottom 3.81: QBL1.D MB1.1 | MB2.1 44.45,11.68 | QBH2.S MB4.1
  pour Top (isolate 0.813, no thermals): 16.38,11.56 16.38,1.27 76.33,1.27 76.33,11.56
MCUXTAL1  (via drill 0.61)
  Top 0.254: CX1.1 144.53,21.34 144.53,16.13 141.99,13.59 139.57,13.59 Q1.1 | v126.75,24 126.75,22.35 U2.24
  Bottom 0.254: v126.75,24 122.3,24 120.9,22.61 120.9,13.46 138.68,13.46 Q1.1
MCUXTAL2  (via drill 0.61)
  Top 0.254: v143.26,18.8 CX2.1 | v125.86,23.11 125.86,22.35 U2.23
  Bottom 0.254: v143.26,18.8 142.88,18.41 139.57,18.41 Q1.2 138.3,18.41 137.54,19.18 121.92,19.18 121.92,20.83 122.94,21.84 124.59,21.84 v125.86,23.11
N$1
  Top 1.27: R11.2 19.43,42.29 24.38,42.29 24.77,42.67 24.77,45.47 26.29,46.99 D2.C
N$2
  Bottom 1.27: C1.1 16.51,26.29 3.68,39.12 3.68,57.78 4.83,58.93 11.43,58.93 16.51,64.01 R3.2
N$3
  Top 0.254: R12.2 41.66,55.88 DRV1.4
N$4  (via drill 0.61)
  Top 0.254: R5.2 108.08,53.68 v108.08,58.04 | LED3.3 102.36,78.05 102.36,77.22 v104.65,74.93
  Bottom 0.254: v108.08,58.04 104.65,61.47 v104.65,74.93
N$5  (via drill 0.61)
  Top 0.254: R1.2 106.81,51.78 106.81,59.31 101.85,59.31 v101.73,59.18 | LED3.1 98.33,71.66 98.3,71.63 98.42,71.5 v98.42,68.33
  Bottom 0.254: v101.73,59.18 101.73,65.02 v98.42,68.33
N$6  (via drill 0.61)
  Top 0.254: U2.30 131.44,21.87 131.44,22.48 129.54,24.38 v128.52,24.38 | v106.43,44.83 104.78,46.1 R4.1
  Bottom 0.254: v128.52,24.38 127.76,25.15 121.16,25.15 107.31,38.99 107.31,43.94 v106.43,44.83
N$7
  Top 1.27: 17.53,36.83 R10.2 16.51,36.83 R9.1
N$8
  Top 1.27: D4.C 22.86,47.12 20.57,47.11 | 20.57,47.11 12.7,54.99 R9.2 | 20.57,47.11 20.57,46.99 D3.C
N$9
  Top 0.254: R13.2 41.15,35.56 DRV2.4
N$10  (via drill 0.61)
  Top 0.254: R4.2 v104.78,57.66 | LED3.4 102.31,71.75 102.23,71.75 102.23,68.45 v103.25,67.44
  Bottom 0.254: v104.78,57.66 103.25,59.18 v103.25,67.44
N$11
  Top 0.254: C5.1 123.83,3.56 123.32,3.56 123.32,6.6 123.57,6.86 U1.1
N$12
  Top 0.254: C6.1 127.64,3.56 127.13,3.56 127.13,6.6 127.38,6.86 U1.4
N$20
  Top 0.254: C6.2 128.65,5.21 128.65,6.86 U1.5
N$22
  Top 0.254: C5.2 125.09,5.21 126.11,6.22 126.11,6.86 U1.3
N$24
  Top 0.254: C7.1 121.28,3.56 122.81,3.56 122.81,8.76 123.19,9.14 124.84,9.14 124.84,8.76 U1.2
N$25  (via drill 0.61)
  Top 0.254: v133.22,68.83 132.33,68.83 U11.7 | v136.65,68.83 136.65,67.94 C22.2 | v142.75,66.55 142.75,64.52 U5.3
  Bottom 0.254: v133.22,68.83 v136.65,68.83 136.78,68.58 140.72,68.58 v142.75,66.55
N$26
  Top 0.254: C8.2 131.44,5.21 130.43,5.59 130.43,6.86 U1.6
N$27  (via drill 0.61)
  Top 0.254: U11.6 132.33,67.56 133.99,67.56 133.99,68.33 134.11,68.45 134.11,71.25 133.99,71.37 133.99,77.22 134.87,78.11 134.87,79.88 135.38,80.39 136.91,80.39 136.91,73.03 C21.2 137.29,71.75 v138.56,70.48 | v144.02,70.48 144.02,69.72 U5.5
  Bottom 0.254: v138.56,70.48 v144.02,70.48
N$28
  Top 0.254: R26.2 147.19,69.22 147.19,71.75 R25.2 R24.1 143.13,71.75 143.13,69.72 U5.6
N$29  (via drill 0.61)
  Top 0.254: R29.2 147.19,62.87 147.19,60.33 R28.2 146.56,59.05 v146.56,58.04 | U5.2 141.73,62.36 141.73,61.72 142.37,61.09 142.37,60.33 R27.1 143.38,59.05 v144.4,58.04
  Bottom 0.254: v144.4,58.04 v146.56,58.04
N$30  (via drill 0.61)
  Top 0.254: U15.D1 114.05,67.31 v113.67,67.69 113.67,67.06 112.65,66.04 CD6.2
  Bottom 0.254: v113.67,67.69 115.19,67.69 125.22,77.72 U16.4
N$31
  Top 0.254: U15.B7 120.65,68.96 123.57,68.96 123.57,69.47 C32.1 123.7,70.23 123.7,75.95 122.17,77.47 122.17,84.33 122.94,85.09 U16.18
N$32
  Top 0.254: U15.C7 120.65,68.2 124.84,68.2 124.84,69.47 C32.2 124.84,70.23 124.84,70.74 124.21,70.74 124.21,83.82 125.48,85.09 U16.17
N$33  (via drill 0.61)
  Top 0.254: v127.51,12.45 127.51,15.37 126.62,16.26 U1.14
  Bottom 0.254: v127.51,12.45 135.89,4.06 141.99,4.06 142.75,3.3 SERIAL.5
N$34
  Top 0.254: U1.13 127.89,16.64 128.02,16.51 128.02,14.99 133.35,9.65 144.53,9.65 144.53,2.41 143.89,1.78 141.99,1.78 SERIAL.3
N$35
  Top 0.254: U1.7 131.57,8.76 131.95,9.14 140.46,9.14 140.46,6.1 SERIAL.4
N$36
  Top 0.254: U1.8 132.97,6.86 139.7,6.86 139.7,4.95 140.34,4.32 142.24,4.32 SERIAL.6
N$37
  Top 0.254: U15.A5 119,69.85 119,71.63 120.52,71.63 121.79,72.9 122.43,72.9 C31.2 122.43,74.42 119.63,77.22 119.63,84.33 120.4,85.09 U16.19
N$38
  Top 0.254: U15.A4 118.11,72.01 118.24,72.14 120.02,72.14 121.14,73.26 C31.1 121.16,74.93 119.13,76.96 119.13,84.33 118.36,85.09 U16.20
N$39  (via drill 0.61)
  Top 0.254: U15.D7 C33.1 124.08,66.93 124.08,66.55 124.84,65.79 126.11,65.79 126.11,65.28 | 126.11,65.28 128.78,65.28 128.78,67.31 132.33,70.87 132.33,84.33 133.1,85.09 U16.14 | v123.32,57.78 126.24,60.71 v126.24,62.23 | v126.24,64.39 126.11,64.52 126.11,65.28
  Bottom 0.254: GYROHV.1 117.98,57.78 v123.32,57.78 | v126.24,62.23 v126.24,64.39
N$40  (via drill 0.61)
  Top 0.254: U15.C1 115.57,68.07 115.06,68.07 115.06,73.28 C34.1 114.94,74.04 114.94,76.07 117.09,76.07 117.35,75.82 v117.35,75.69
  Bottom 0.254: v117.35,75.69 120.4,75.69 122.56,77.85 U16.3
OC1A  (via drill 0.61)
  Top 0.254: U4.4 114.05,81.79 115.7,81.79 115.7,78.23 U4.1 113.28,77.98 v113.28,72.26 | v122.68,18.29 120.4,20.57 120.4,22.86 119.89,23.37 U2.16 118.75,23.5 118.36,23.88 118.36,28.7 115.57,28.7 113.92,30.35 113.92,51.82 v113.28,52.45 | v133.86,18.29 138.18,22.61 138.18,24.51 R18.8
  Bottom 0.254: v122.68,18.29 v133.86,18.29 | v113.28,52.45 113.28,64.77 111.63,64.77 111.63,70.61 v113.28,72.26
PB1  (via drill 0.61)
  Top 0.254: v121.79,27.56 119.89,27.56 U2.11
  Bottom 0.254: v121.79,27.56 134.75,27.56 137.03,25.27 144.02,25.27 149.73,19.56 149.73,16.38 PROG.3
PITCH_RATE  (via drill 0.61)
  Top 0.254: U15.B1 115.82,69.09 115.82,72.9 116.33,73.41 C34.2 116.35,74.56 v115.82,75.06 | v124.46,36.07 124.46,36.83 U2.60
  Bottom 0.254: v124.46,36.07 149.22,36.07 150.75,37.59 150.75,46.99 147.19,46.99 146.43,47.75 146.43,52.07 149.99,52.07 150.75,52.83 150.75,79.38 147.19,79.38 XPITCHGYRO.3 144.65,80.39 144.15,80.9 129.54,80.9 | 129.54,80.9 122.56,80.9 121.28,79.63 U16.2 120.65,78.23 119.38,76.96 115.82,76.96 v115.82,75.06 | PITCH_RATE.1 129.54,76.07 129.54,80.9
PWMA  (via drill 0.61)
  Top 0.254: v36.83,52.45 36.83,52.32 37.72,52.32 DRV1.1 | v111.12,82.04 112.14,81.03 U4.3 | v52.83,80.01 52.32,79.5 52.32,69.85 46.86,64.39 v46.86,52.45
  Bottom 0.254: v111.12,82.04 110.87,82.3 53.59,82.3 52.83,81.53 v52.83,80.01 | v36.83,52.45 v46.86,52.45
PWMB  (via drill 0.61)
  Top 0.254: U4.6 114.05,84.84 114.43,85.22 114.43,87 105.54,87 105.54,65.66 91.95,65.66 87.38,61.09 77.22,61.09 50.8,34.67 v46.99,34.67 | DRV2.1 39.75,31.75 40.39,31.11 43.81,31.11 43.81,34.16 v44.32,34.67
  Bottom 0.254: v44.32,34.67 v46.99,34.67
PWRUP  (via drill 0.61)
  Top 1.27: CE23.+ 42.8,43.18 D5.C D2.A | X1.3 v15.24,48.26
  Bottom 1.27: CE23.+ 43.18,43.56 64.39,43.56 U3.1 | v15.24,48.26 20.19,48.26 20.7,48.77 35.18,48.77 36.83,47.12 D2.A
Q1G
  Top 1.016: RGAH1.2 56.26,74.93 56.26,79.63 QAH1.G
Q2G
  Top 1.016: RGAH2.2 74.04,74.93 74.04,79.63 QAH2.G
Q3G
  Top 1.016: RGAL1.2 20.7,74.93 20.7,79.63 QAL1.G
Q4G
  Top 1.016: RGAL2.2 38.48,74.93 38.48,79.63 QAL2.G
Q5G
  Top 1.016: RGBH1.2 68.2,16.51 68.2,11.81 QBH1.G
Q6G
  Top 1.016: RGBH2.2 85.98,16.51 85.98,11.81 QBH2.G
Q7G
  Top 1.016: RGBL1.2 32.64,16.51 32.64,11.81 QBL1.G
Q8G
  Top 1.016: RGBL2.2 50.42,16.51 50.42,11.81 QBL2.G
RT_ACCEL  (via drill 0.61)
  Top 0.254: v126.75,38.73 126.75,37.97 U2.57 | v142.88,40.51 145.41,43.05 145.41,58.8 142.24,61.98 142.24,65.79 141.86,66.17 141.86,67.56 U5.7 141.48,69.72 141.48,71.75 R24.2 141.39,75.44 RT_ACCEL.1
  Bottom 0.254: v126.75,38.73 128.52,40.51 v142.88,40.51
RXD0  (via drill 0.61)
  Top 0.254: v122.68,23.11 122.68,34.8 119.89,34.8 U2.2 | v128.91,15.37 U1.12
  Bottom 0.254: v122.68,23.11 122.68,22.35 121.41,21.08 121.41,15.37 v128.91,15.37 138.3,15.37 138.81,15.88 145.67,15.88 PROG.4
RXD1  (via drill 0.61)
  Top 0.254: v129.29,23.11 129.29,22.35 U2.27 | v133.86,20.57 132.97,19.68 132.97,18.54 U1.9
  Bottom 0.254: v129.29,23.11 131.83,20.57 v133.86,20.57
TXD0  (via drill 0.61)
  Top 0.254: v117.98,34.04 118.75,34.04 U2.3 | U1.11 130.43,16.13 134.24,12.32 144.02,12.32 145.54,13.84 147.7,13.84 148.08,13.34 PROG.1
  Bottom 0.254: v117.98,34.04 120.14,31.75 132.84,31.75 137.16,27.56 147.96,27.56 150.24,25.27 150.24,14.35 PROG.1
TXD1
  Top 0.254: U2.28 130.05,21.21 130.05,19.56 131.57,18.03 U1.10
VB1
  Top 0.813: 28.83,53.21 D8.3 | DRV1.13 32.36,53.21 28.83,53.21 | 28.83,53.21 27.56,54.48 C2.1
VB2
  Top 0.813: C4.1 29.21,34.42 29.21,33.02 29.34,33.02 | 29.34,33.02 DRV2.13 | D9.3 29.34,33.02
VBATSENSE  (via drill 0.61)
  Top 0.254: v125.48,44.07 125.48,39.62 125.09,39.62 123.7,38.23 123.7,37.97 U2.61 | v124.71,45.85 123.83,46.74 C10.1 R6.2 | v112.01,62.1 112.01,62.87 107.7,62.87 R2.1
  Bottom 0.254: v125.48,44.07 125.48,45.85 v124.71,45.85 124.33,46.1 115.32,46.1 112.01,49.4 v112.01,62.1
VCC  (via drill 0.61)
  Top 0.254: 131.44,56.52 R15.2 | 109.22,7.62 U13.2 | U2.21 124.33,22.23 | 122.17,14.61 122.11,14.67 | U2.52 130.81,37.97 | 149.86,49.15 150.75,50.04 150.75,51.56 149.86,52.45 XDASH.7 | 145.67,27.56 R18.11 144.91,27.18 | 145.67,28.32 R18.12 145.67,28.83 | R18.13 145.67,29.59 | 140.34,67.56 U5.8 140.08,69.72 139.45,70.36 139.45,81.79 136.14,85.09 U16.13 | 107.19,77.98 U4.14 | 110.62,74.3 CD9.1 110.73,73.42 v111.51,72.64 | U15.E7 120.65,66.29 v122.56,66.29 122.56,66.04 123.7,64.9 CD8.1 | 119.38,42.42 L1.1 | 124.21,19.81 CD1.1 | 145.03,26.16 R18.10 | 98.55,78.3 LED3.2 | CD7.1 119.38,72.77 117.35,72.77 | 117.35,72.77 117.35,69.85 117.31,69.81 U15.A3 | 117.35,72.77 116.97,72.77 v116.71,72.52
  Top 0.406: 128.91,56.9 130.18,56.9 R15.2 | 128.91,56.9 127.64,56.9 R17.2 | 131.44,56.52 131.83,56.13 133.73,56.13 U10.16 133.73,54.23 133.22,53.72 133.22,44.96 130.81,42.55 130.81,40.26 | 124.21,19.81 124.33,20.07 U2.21 | 124.33,22.23 124.33,24.26 130.68,30.61 130.68,36.96 U2.52 | 130.81,37.97 130.81,40.26 | v119.38,61.09 119.38,42.42 | 128.91,56.9 v128.91,57.28 | 130.81,40.26 CD10.1
  Top 0.61: CD17.1 109.22,6.73 | 109.22,6.73 109.22,7.62 | CD16.1 121.67,14.22 122.11,14.67 123.57,16.13 123.57,16.64 U1.16 123.83,18.29 124.21,18.67 124.21,19.81 | 109.22,6.73 VCC.1 120.65,6.73 | 120.65,6.73 122.17,6.73 122.17,14.61 | 109.22,6.73 109.22,7.87 U13.2 | SERIAL.8 145.92,12.06 PROG.2 | 149.86,49.15 XDASH.5 147.32,47.37 146.05,46.1 146.05,41.02 143.64,38.61 143.64,37.21 144.15,36.7 144.15,30.61 144.91,29.84 R18.13 | 145.67,28.32 145.67,27.56 | 145.67,29.59 145.67,28.83 | v142.11,14.99 142.11,24.38 143.89,26.16 | 144.91,27.18 143.89,26.16 | 140.34,67.56 140.34,67.31 137.67,64.64 CD15.1 | 107.19,76.58 107.19,74.93 109.98,74.93 110.62,74.3 | 107.19,76.58 107.19,77.98 | 120.65,6.73 C7.2 | 143.89,26.16 145.03,26.16 | v98.42,81.28 98.55,78.3 | 107.19,76.58 v108.08,76.58
  Bottom 0.254: XPITCHGYRO.1 144.78,84.58 137.41,84.58 136.53,85.47 U16.13 135.25,85.47 131.32,81.53 116.2,81.53 115.7,81.03 115.7,79.76 117.6,79.76 U16.1
  Bottom 0.61: v142.11,14.99 143.51,14.99 145.41,13.08 PROG.2 | 119.38,66.29 v122.56,66.29 | 119.38,66.29 112.27,66.29 112.27,69.47 114.81,72.01 114.81,72.52 | 114.43,73.79 114.43,77.85 117.22,77.85 U16.1 | 114.81,72.52 114.81,73.41 114.43,73.79 | 119.38,66.29 v119.38,61.09 119.38,59.94 120.14,59.18 128.91,59.18 | v111.51,72.64 112.65,73.79 114.43,73.79 | 128.91,59.18 141.22,59.18 146.81,53.72 XDASH.7 | v128.91,57.28 128.91,59.18 | v98.42,81.28 103.12,76.58 v108.08,76.58 | 114.81,72.52 v116.71,72.52